# Altium project cat.PrjPcb (part 6 of 6)

## Sheet blinkenlights.SchDoc: Blinkenlights
size A4; SheetNumber: 6; SheetTotal: 6
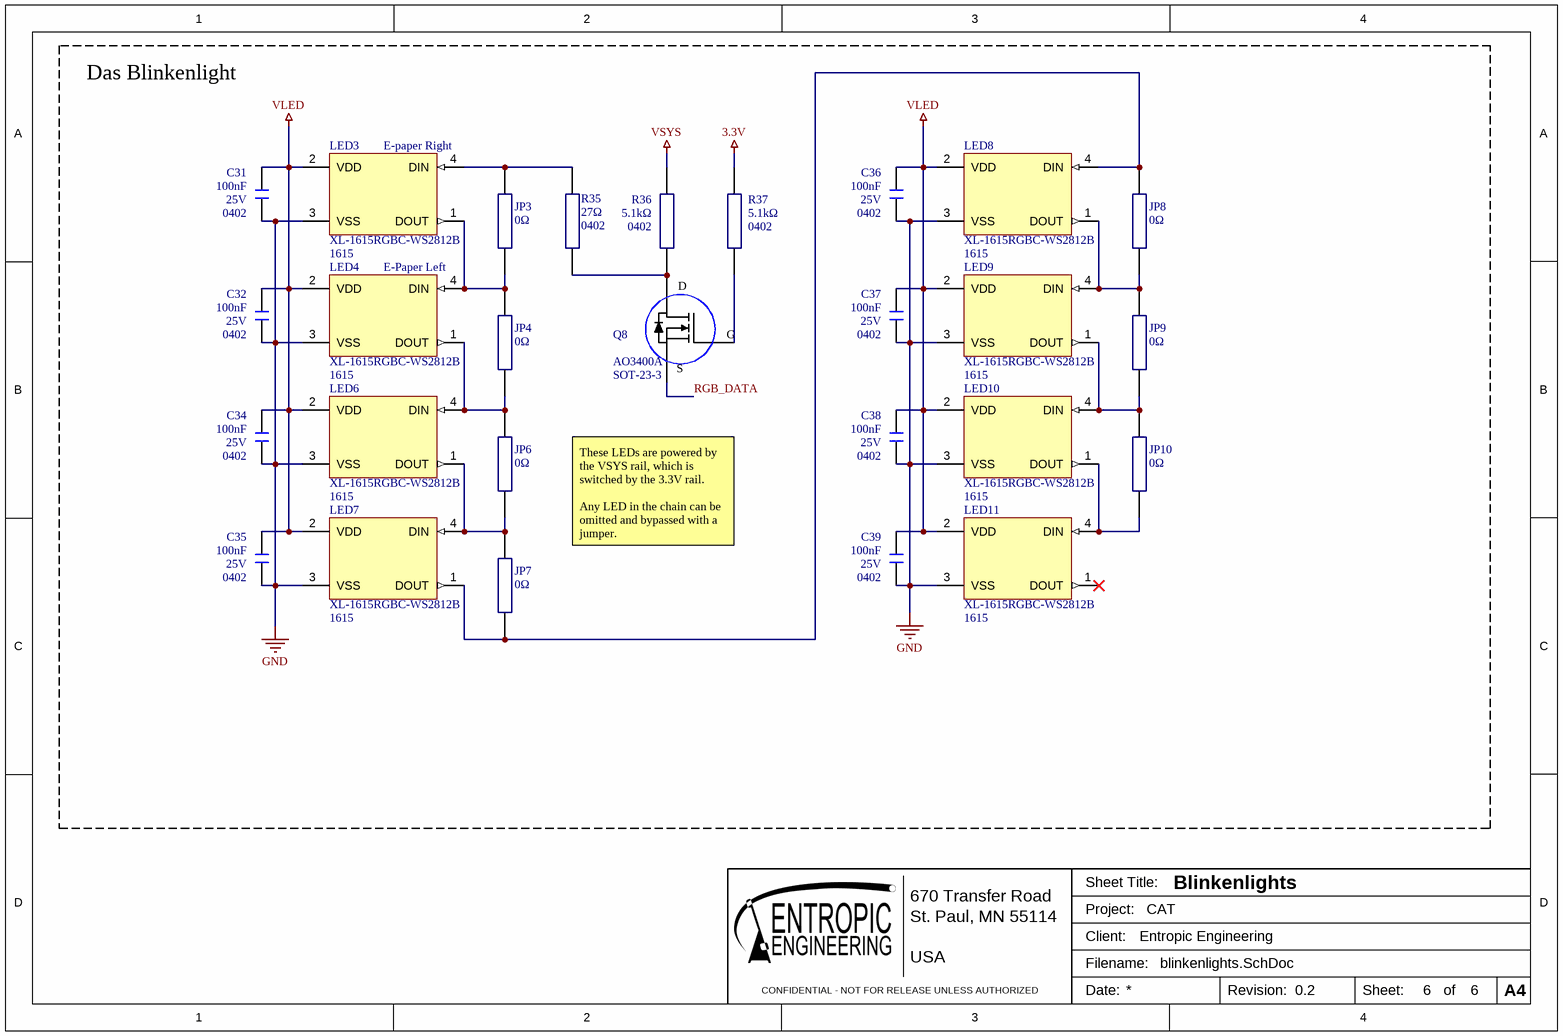
[diagram p6: blinkenlights.SchDoc]

### Parts
C31  Case Code (Imperial): 0402  Voltage: 25V  Capacitance: 100nF  [0402_capacitor]  (hidden comment: GRM155R71E104KE14D)
C32  Case Code (Imperial): 0402  Voltage: 25V  Capacitance: 100nF  [0402_capacitor]  (hidden comment: GRM155R71E104KE14D)
C34  Case Code (Imperial): 0402  Voltage: 25V  Capacitance: 100nF  [0402_capacitor]  (hidden comment: GRM155R71E104KE14D)
C35  Case Code (Imperial): 0402  Voltage: 25V  Capacitance: 100nF  [0402_capacitor]  (hidden comment: GRM155R71E104KE14D)
C36  Case Code (Imperial): 0402  Voltage: 25V  Capacitance: 100nF  [0402_capacitor]  (hidden comment: GRM155R71E104KE14D)
C37  Case Code (Imperial): 0402  Voltage: 25V  Capacitance: 100nF  [0402_capacitor]  (hidden comment: GRM155R71E104KE14D)
C38  Case Code (Imperial): 0402  Voltage: 25V  Capacitance: 100nF  [0402_capacitor]  (hidden comment: GRM155R71E104KE14D)
C39  Case Code (Imperial): 0402  Voltage: 25V  Capacitance: 100nF  [0402_capacitor]  (hidden comment: GRM155R71E104KE14D)
JP3  value 0Ω  [0402_resistor]  (hidden comment: RC0402FR-070RL)
JP4  value 0Ω  [0402_resistor]  (hidden comment: RC0402FR-070RL)
JP6  value 0Ω  [0402_resistor]  (hidden comment: RC0402FR-070RL)
JP7  value 0Ω  [0402_resistor]  (hidden comment: RC0402FR-070RL)
JP8  value 0Ω  [0402_resistor]  (hidden comment: RC0402FR-070RL)
JP9  value 0Ω  [0402_resistor]  (hidden comment: RC0402FR-070RL)
JP10  value 0Ω  [0402_resistor]  (hidden comment: RC0402FR-070RL)
LED3  E-paper Right  Package: 1615  [XL-1615RGBC-WS2812B]
LED4  E-Paper Left  Package: 1615  [XL-1615RGBC-WS2812B]
LED6  Package: 1615  [XL-1615RGBC-WS2812B]  (hidden comment: XL-1615RGBC-WS2812B)
LED7  Package: 1615  [XL-1615RGBC-WS2812B]  (hidden comment: WS2812B)
LED8  Package: 1615  [XL-1615RGBC-WS2812B]  (hidden comment: XL-1615RGBC-WS2812B)
LED9  Package: 1615  [XL-1615RGBC-WS2812B]  (hidden comment: WS2812B)
LED10  Package: 1615  [XL-1615RGBC-WS2812B]  (hidden comment: XL-1615RGBC-WS2812B)
LED11  Package: 1615  [XL-1615RGBC-WS2812B]  (hidden comment: WS2812B)
Q8  Case/Package: SOT-23-3  [SOT95P280X115-3N]  (hidden comment: N-FET)
R35  Resistance: 27Ω  Size Code: 0402  [0402_resistor]  (hidden comment: RMCF0402FT27R0)
R36  value 5.1kΩ  Case/Package: 0402  [0402_resistor]  (hidden comment: RC0402FR-075K1L)
R37  value 5.1kΩ  Case/Package: 0402  [0402_resistor]  (hidden comment: RC0402FR-075K1L)

### Blocks framed on the sheet
Das Blinkenlight: C31 C32 C34-C39 JP3 JP4 JP6-JP10 LED3 LED4 LED6-LED11 Q8 R35-R37

### Nets
3.3V: R37.2
GND: C31.1 C32.1 C34.1 C35.1 C36.1 C37.1 C38.1 C39.1 LED3.3(VSS) LED4.3(VSS) LED6.3(VSS) LED7.3(VSS) LED8.3(VSS) LED9.3(VSS) LED10.3(VSS) LED11.3(VSS)
VLED: C31.2 C32.2 C34.2 C35.2 C36.2 C37.2 C38.2 C39.2 LED3.2(VDD) LED4.2(VDD) LED6.2(VDD) LED7.2(VDD) LED8.2(VDD) LED9.2(VDD) LED10.2(VDD) LED11.2(VDD)
VSYS: R36.2
RGB_DATA: Q8.2(S)
NetJP3_1: JP3.1 LED3.4(DIN) R35.2
NetJP3_2: JP3.2 JP4.1 LED3.1(DOUT) LED4.4(DIN)
NetJP4_2: JP4.2 JP6.1 LED4.1(DOUT) LED6.4(DIN)
NetJP6_2: JP6.2 JP7.1 LED6.1(DOUT) LED7.4(DIN)
NetJP7_2: JP7.2 JP8.1 LED7.1(DOUT) LED8.4(DIN)
NetJP8_2: JP8.2 JP9.1 LED8.1(DOUT) LED9.4(DIN)
NetJP9_2: JP9.2 JP10.1 LED9.1(DOUT) LED10.4(DIN)
NetJP10_2: JP10.2 LED10.1(DOUT) LED11.4(DIN)
NetQ8_1: Q8.1(G) R37.1
NetQ8_3: Q8.3(D) R35.1 R36.1

Not connected (* = marked no-connect by the designer): LED11 1(DOUT)*

### Notes on the sheet
- These LEDs are powered by the VSYS rail, which is switched by the 3.3V rail.
  Any LED in the chain can be omitted and bypassed with a jumper.
- 670 Transfer Road
- St. Paul, MN 55114
- Sheet Title:
- Project:
- CONFIDENTIAL - NOT FOR RELEASE UNLESS AUTHORIZED
- USA
- Client:
- Filename:
- Date:
- Revision:
- Sheet:
- of
- A4

### Library data of the parts
C31 C32 C34-C39 = GRM155R71E104KE14D: 100 nF, 25 V, X7R, 0402 Chip capacitor; Manufacturer: Murata; house_part_number: C-100nF-0402-002; Dielectric Material: Ceramic; Tolerance: 10%; Supplier 1: Digi-Key; Supplier Part Number 1: 490-10698-1-ND; RoHS: Yes; Category: Ceramic Capacitors; Pricing 1: 1=0.10000, 10=0.02700, 50=0.01460, 100=0.01190, 500=0.00848, 1000=0.00666, 2500=0.00605, 5000=0.00557 (USD); Mount: Surface Mount; Case/Package: 0402; Case Code (Metric): 1005; Weight: 0.000212oz; Min Operating Temperature: -55°C; Max Operating Temperature: 125°C; Packaging: Tape and Reel; Voltage Rating: 25V; Dielectric: X7R; Termination: SMD/SMT; Resistor Type: Ceramic; Voltage Rating (DC): 25V; Package Quantity: 10000; Length: 1mm; Width: 0.02inch; Height: 0.5mm; Thickness: 0.022inch; Depth: 0.5mm; REACH SVHC: Unknown; Lead Free: Lead Free; RoHS Compliant: Yes; ComponentLink1URL: http://www.farnell.com/datasheets/1872206.pdf?src-supplier=Farnell; ComponentLink1Description: http://www.farnell.com/datasheets/1872206.pdf?src-supplier=Farnell; ComponentLink2URL: http://components.arrow.com/part/dataview/0323_06361249?src-supplier=Arrow+Europe; ComponentLink2Description: http://components.arrow.com/part/dataview/0323_06361249?src-supplier=Arrow+Europe; ComponentLink3URL: http://uk.rs-online.com/webdocs/144c/0900766b8144c113.pdf?src-supplier=RSComponents; ComponentLink3Description: http://uk.rs-online.com/webdocs/144c/0900766b8144c113.pdf?src-supplier=RSComponents; ComponentLink4URL: http://www.farnell.com/datasheets/2048008.pdf?src-supplier=Farnell; ComponentLink4Description: http://www.farnell.com/datasheets/2048008.pdf?src-supplier=Farnell; ComponentLink5URL: http://www.mouser.com/ds/2/281/c02e-2905.pdf?src-supplier=Mouser; ComponentLink5Description: http://www.mouser.com/ds/2/281/c02e-2905.pdf?src-supplier=Mouser; ComponentLink6URL: http://www.farnell.com/datasheets/2048008.pdf?src-supplier=Newark; ComponentLink6Description: http://www.farnell.com/datasheets/2048008.pdf?src-supplier=Newark; ComponentLink7URL: https://search.murata.co.jp/Ceramy/image/img/A01X/G101/ENG/GRM155R71E104KE14-01.pdf?src-supplier=Digi-Key; ComponentLink7Description: https://search.murata.co.jp/Ceramy/image/img/A01X/G101/ENG/GRM155R71E104KE14-01.pdf?src-supplier=Digi-Key; ComponentLink8URL: http://www.farnell.com/datasheets/2048008.pdf?src-supplier=Element14; ComponentLink8Description: http://www.farnell.com/datasheets/2048008.pdf?src-supplier=Element14; ComponentLink9URL: http://psearch.en.murata.com/capacitor/product/GRM155R71E104KE14%23.pdf?src-supplier=Avnet; ComponentLink9Description: http://psearch.en.murata.com/capacitor/product/GRM155R71E104KE14%23.pdf?src-supplier=Avnet; Manufacturer Part Number: GRM155R71E104KE14D
JP3 JP4 JP6-JP10 = RC0402FR-070RL: as JP12-JP15 on sheet sensors; Manufacturer Part Number: RC0402FR-070RL; RoHS: Yes; Category: Chip SMD Resistors; Stock: 580000; Pricing: 10000=0.00093 (USD); Mounting Technology: Surface Mount; Contact Plating: Tin,Matte; Case Code (Imperial): 0402; Case Code (Metric): 1005; Min Operating Temperature: -55°C; Max Operating Temperature: 155°C; Packaging: Tape and Reel; Termination: SMD/SMT; Features: Moisture Resistant; Series: RC; Number of Terminations: 2; Length: 1mm; Width: 0.5mm; Height: 0.35mm; RoHS Compliant: Yes; Lead Free: 5697LeadFree; Supplier 1: Avnet; Supplier Part Number 1: RC0402FR-070RL
LED3 LED4 LED6-LED11 = XL-1615RGBC-WS2812B: 1-wire addressable RGB LED, 1615; Manufacturer: XINGLIGHT; Manufacturer Part Number: XL-1615RGBC-WS2812B; Supplier 1: LCSC; RoHS: No; Stock 1: 257799; Pricing 1: 10=0.0454, 100=0.0362, 300=0.0315, 1000=0.0276, 4000=0.0263, 8000=0.0253 (USD); Supplier Part Number 1: C5349954
Q8 = AO3400A: N-FET, 30V, 5.7A, SOT-23-3; Manufacturer: Alpha & Omega Semiconductor; Rds On Max: 26.5mR; Input Capacitance: 630pF; Max Power Dissipation: 1.4W; Drain to Source Resistance: 18mR; Number of Channels: 1NUMBER; Threshold Voltage: 650mV; Turn-Off Delay Time: 25ns; Turn-On Delay Time: 3ns; Supplier: Arrow Electronics; RoHS: Yes; Category: MOSFETs; Stock: 141000; Pricing: 3000=0.0899, 6000=0.0869, 9000=0.0763, 30000=0.0746, 75000=0.0627 (USD); Mounting Technology: Surface Mount; Min Operating Temperature: -55°C; Max Operating Temperature: 150°C; Packaging: Cut Tape; Drain to Source Voltage (Vdss): 30V; Continuous Drain Current (ID): 5.7A; Series: -; Drain to Source Breakdown Voltage: 30V; Height: 1.25mm; Lead Free: Lead Free; RoHS Compliant: Yes; ComponentLink1URL: https://datasheet.ciiva.com/940/ao3400a-940739.pdf?src-supplier=Digikey; ComponentLink1Description: https://datasheet.ciiva.com/940/ao3400a-940739.pdf?src-supplier=Digikey; ComponentLink2URL: https://datasheet.ciiva.com/26906/getdatasheetpartid-64438-26906526.pdf?src-supplier=Verical; ComponentLink2Description: https://datasheet.ciiva.com/26906/getdatasheetpartid-64438-26906526.pdf?src-supplier=Verical; ComponentLink3URL: https://datasheet.ciiva.com/940/ao3400a-940740.pdf?src-supplier=Digikey; ComponentLink3Description: https://datasheet.ciiva.com/940/ao3400a-940740.pdf?src-supplier=Digikey; ComponentLink4URL: https://datasheet.ciiva.com/940/ao3400a-940741.pdf?src-supplier=Digikey; ComponentLink4Description: https://datasheet.ciiva.com/940/ao3400a-940741.pdf?src-supplier=Digikey; Manufacturer Part Number: AO3400A; house_part_number: AO3400A; Supplier Part Number 1: AO3400A
R35 = RMCF0402FT27R0: 27 Ω, 0402 Chip resistor; Manufacturer: Stackpole Electronics; house_part_number: R-27-0402-1%-001; Tolerance: 1%; Rated Power Dissipation (P): 63mW; Rated Temperature: 70°C; Temperature Coefficient: 100ppm/°C; Working Voltage: 50V; Package Height: 0.3mm; Package Length: 1mm; Package Width: 0.5mm; Reference Standard: AEC-Q200; Supplier 1: Digi-Key; Supplier Part Number 1: RMCF0402FT27R0CT-ND; RoHS: Yes; Category: Chip SMD Resistors; Stock 1: 3710; Pricing 1: 1=0.10000, 10=0.01500, 100=0.00610, 1000=0.00274, 2500=0.00238, 5000=0.00197 (USD); Mount: Surface Mount; Number of Pins: 2; Package Shape: Rectangular; Terminal Finish: Nickel; Min Operating Temperature: -55°C; Max Operating Temperature: 155°C; JESD-609 Code: e3; Resistor Type: FIXED RESISTOR; Construction: Rectangular; Package Style: SMTMeter; Packaging: Tape and Reel; Technology: METAL GLAZE/THICK FILM; Termination: Wraparound; REACH SVHC: Yes; RoHS Compliant: Yes; ComponentLink1URL: https://datasheet.ciiva.com:443/pdfs/VipMasterIC/IC/SEIE/SEIE-S-A0009541969/SEIE-S-A0009541969-1.pdf?src-supplier=IHS+Markit; ComponentLink1Description: https://datasheet.ciiva.com:443/pdfs/VipMasterIC/IC/SEIE/SEIE-S-A0009541969/SEIE-S-A0009541969-1.pdf?src-supplier=IHS+Markit; ComponentLink2URL: https://www.seielect.com/catalog/SEI-RMCF_RMCP.pdf?src-supplier=Avnet; ComponentLink2Description: https://www.seielect.com/catalog/SEI-RMCF_RMCP.pdf?src-supplier=Avnet; ComponentLink3URL: https://www.seielect.com/catalog/sei-rmcf_rmcp.pdf?src-supplier=Digi-Key; ComponentLink3Description: https://www.seielect.com/catalog/sei-rmcf_rmcp.pdf?src-supplier=Digi-Key; ComponentLink4URL: http://www.seielect.com/Catalog/SEI-RMCF_RMCP.pdf?src-supplier=Digi-Key; ComponentLink4Description: http://www.seielect.com/Catalog/SEI-RMCF_RMCP.pdf?src-supplier=Digi-Key; Manufacturer Part Number: RMCF0402FT27R0
R36 R37 = RC0402FR-075K1L: 5.1 kΩ, 0402 Chip resistor; Manufacturer: Yageo; house_part_number: R-5.1k-0402-1%-001; Power Rating: 63mW; Tolerance: 1%; Temperature Coefficient: 100ppm/°C; Voltage Rating: 50V; Manufacturer Part Number: RC0402FR-075K1L; RoHS: Yes; Category: Chip SMD Resistors; Stock: 1190000; Pricing: 10000=0.0024, 50000=0.0023, 250000=0.0021, 500000=0.0021, 1500000=0.0019 (USD); Case Code (Metric): 1005; Case Code (Imperial): 0402; Min Operating Temperature: -55°C; Max Operating Temperature: 155°C; Technology: THICK FILM; Packaging: Tape and Reel; Package Quantity: 1; Resistor Type: Thick Film; Number of Terminations: 2; Termination: SMD/SMT; Max Power Dissipation: 63mW; Working Voltage: 50V; Features: Moisture Resistant; Series: RC; Resistance Tolerance: 1%; Construction: Rectangular; Voltage Rating (DC): 50V; Length: 1mm; Width: 0.02inch; Height: 0.016inch; Depth: 0.5mm; RoHS Compliant: Yes; Military Standard: Not; Reach SVHC Compliant: Unknown; Lead Free: 5697LeadFree; ComponentLink1URL: https://datasheet.ciiva.com/7983/1018594-7983519.pdf?src-supplier=Element14; ComponentLink1Description: https://datasheet.ciiva.com/7983/1018594-7983519.pdf?src-supplier=Element14; ComponentLink2URL: https://datasheet.ciiva.com/46394/1018594-46394936.pdf?src-supplier=Element14; ComponentLink2Description: https://datasheet.ciiva.com/46394/1018594-46394936.pdf?src-supplier=Element14; ComponentLink3URL: https://datasheet.ciiva.com/2453/pyu-r-int-thick-7-2453401.pdf?src-supplier=Digikey; ComponentLink3Description: https://datasheet.ciiva.com/2453/pyu-r-int-thick-7-2453401.pdf?src-supplier=Digikey; ComponentLink4URL: https://datasheet.ciiva.com/2453/pyu-r-int-thick-7-2453402.pdf?src-supplier=Digikey; ComponentLink4Description: https://datasheet.ciiva.com/2453/pyu-r-int-thick-7-2453402.pdf?src-supplier=Digikey; ComponentLink5URL: https://datasheet.ciiva.com/2453/pyu-r-int-thick-7-2453400.pdf?src-supplier=Digikey; ComponentLink5Description: https://datasheet.ciiva.com/2453/pyu-r-int-thick-7-2453400.pdf?src-supplier=Digikey; ComponentLink6URL: https://datasheet.ciiva.com/12558/pyu-rc0402-51-rohs-l-6-r-8721-12558460.pdf?src-supplier=Mouser; ComponentLink6Description: https://datasheet.ciiva.com/12558/pyu-rc0402-51-rohs-l-6-r-8721-12558460.pdf?src-supplier=Mouser; ComponentLink7URL: https://datasheet.ciiva.com/16744/pyu-rc0402-51-rohs-l-6-r-16744283.pdf?src-supplier=Future+Electronics; ComponentLink7Description: https://datasheet.ciiva.com/16744/pyu-rc0402-51-rohs-l-6-r-16744283.pdf?src-supplier=Future+Electronics; ComponentLink8URL: https://datasheet.ciiva.com/15189/getdatasheetpartid-323636-15189493.pdf?src-supplier=Verical; ComponentLink8Description: https://datasheet.ciiva.com/15189/getdatasheetpartid-323636-15189493.pdf?src-supplier=Verical; Supplier 1: Future Electronics; Supplier Part Number 1: 6053649

## Nets that join several sheets
3.3V: radios (10 pins), user_interface (D9.K LS1.+), power (8 pins), display (8 pins), sensors (13 pins), blinkenlights (R37.2)
3.3V_nRF: radios (8 pins), user_interface (R61.1), power (Q2.1)
2350_3.3V: microcontroller (27 pins), user_interface (7 pins), power (Q11.3 TP47.1), display (11 pins), sensors (JP12.1 JP14.1)
+5V: power (6 pins), sensors (C41.2 C44.2 J7.1 M2.2)
GND: microcontroller (28 pins), radios (45 pins), user_interface (21 pins), power (39 pins), display (53 pins), sensors (21 pins), blinkenlights (16 pins)
VBUS: radios (C4.1 M1.F6), power (15 pins)
VLED: power (Q3.3 TP65.1), blinkenlights (16 pins)
VSYS: radios (C5.2 M1.F4), power (12 pins), blinkenlights (R36.2)
2350_3.3V_EN: radios (M1.Z2 TP39.1), power (R44.1)
2350_BOOT: microcontroller (R56.2), radios (M1.Z0 TP38.1)
2350_MISO: microcontroller (J8.7 TP60.1 U8.7), radios (M1.E6)
2350_MOSI: microcontroller (J8.3 TP59.1 U8.5), radios (M1.11)
2350_~{RST}: microcontroller (TP49.1 U8.26), radios (M1.Z1)
2350_SCK: microcontroller (J8.5 TP58.1 U8.4), radios (M1.A3)
2350_SCL: microcontroller (R51.2 TP66.1 U8.10), display (TP16.1 U5.10), sensors (U6.4)
2350_SDA: microcontroller (R50.2 TP62.1 U8.9), display (TP17.1 U5.9), sensors (U6.6)
~{LCD_RESET}: microcontroller (TP78.1 U8.29), display (J6.32)
BARO_INT/RDY: radios (M1.C1 TP3.1), sensors (U7.7)
BATT_SENSE: microcontroller (TP89.1 U8.43), radios (M1.5 TP27.1), power (Q2.2 R24.2)
BUCK_ENABLE: radios (M1.6 TP29.1), power (R40.1 R41.2 U9.1)
CO2_nRDY: radios (M1.A2 TP18.1), sensors (M2.7)
DISPLAY_DI: microcontroller (TP75.1 U8.19), radios (M1.E3), display (J5.14 J6.23)
DISPLAY_RS/CD: microcontroller (TP76.1 U8.27), display (J5.11 J6.29)
DISPLAY_SCK: microcontroller (TP74.1 U8.18), display (J5.13 J6.30)
EPD_~{BSY}: microcontroller (TP71.1 U8.15), radios (M1.E2), display (J5.9)
EPD_~{CS}: microcontroller (TP73.1 U8.17), radios (M1.D2 TP31.1), display (J5.12)
EPD_~{RST}: microcontroller (TP72.1 U8.16), radios (M1.E1), display (J5.10)
IMU_INT1: microcontroller (TP68.1 U8.13), sensors (U6.11)
IMU_INT2: microcontroller (TP70.1 U8.14), sensors (U6.9)
LCD_BL: microcontroller (TP79.1 U8.31), display (R31.1)
LCD_~{CS}: microcontroller (TP77.1 U8.28), display (J6.31)
LED_CONTROL: radios (M1.A1 TP30.1), power (R28.1)
nRF_~{CS}: microcontroller (TP57.1 U8.3), radios (M1.B5)
nRF_SCL: radios (M1.2 R9.2 TP36.1), sensors (J7.4 M2.5 U7.2)
nRF_SDA: radios (M1.1 R8.2 TP35.1), sensors (J7.3 M2.4 U7.4)
RGB_DATA: radios (M1.D6 TP34.1), blinkenlights (Q8.2)
SEN55_BOOST: radios (M1.E0 TP37.1), power (U4.6)
SPEAKER_OUT: microcontroller (TP56.1 U8.2), user_interface (R5.1)
SW_A: microcontroller (TP83.1 U8.35), user_interface (R1.2 SW6.1 SW6.2)
SW_B: microcontroller (TP84.1 U8.36), user_interface (R2.2 SW5.1 SW5.2)
SW_DOWN: microcontroller (TP85.1 U8.37), user_interface (R4.2 SW4.1 SW4.2)
SW_LEFT: microcontroller (TP86.1 U8.40), user_interface (R58.2 SW2.1 SW2.2)
SW_RESET: radios (M1.14 TP33.1), user_interface (SW9.3 SW9.4)
SW_RIGHT: microcontroller (TP87.1 U8.41), user_interface (R59.2 SW3.1 SW3.2)
SW_SELECT: microcontroller (TP82.1 U8.34), user_interface (R60.2 SW8.1 SW8.2)
SW_START: microcontroller (TP81.1 U8.33), user_interface (D1.A R61.2)
SW_UP: microcontroller (TP88.1 U8.42), user_interface (R3.2 SW1.1 SW1.2)
SYNC/ALIVE: microcontroller (TP80.1 U8.32), radios (M1.Z3)
TOUCH_INT: microcontroller (TP67.1 U8.12), display (U5.7)
USB0_D+: radios (R10.1), power (J4.A6 J4.B6 U2.1 U2.6)
USB0_D-: radios (R11.1), power (J4.A7 J4.B7 U2.3 U2.4)

## Assembly variants
default_variant: not fitted D11 J1 JP1 JP3 JP4 JP6 JP7 JP8 JP9 JP10 JP13 JP15 R7 R21 R27 R39 R40 R57 R? R?